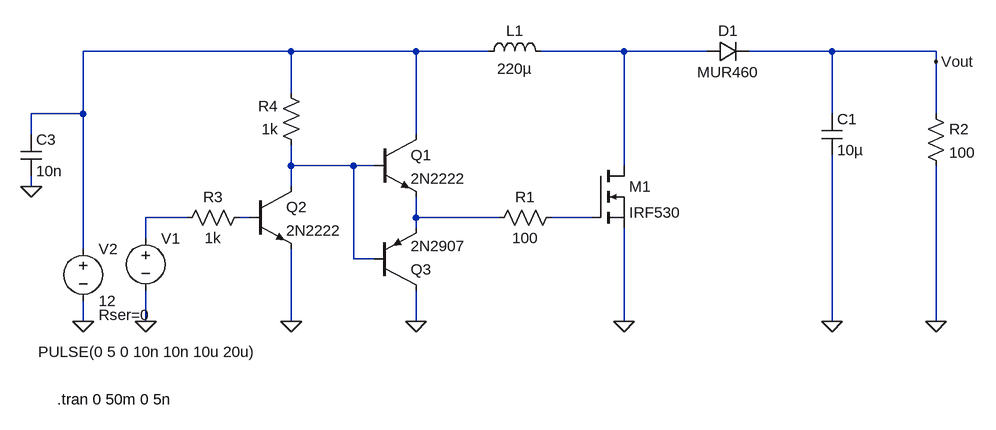
[diagram p0: schematic sim2.asc]
sim2.asc, the LTspice schematic file:
Version 4
SHEET 1 1204 748
WIRE 144 -144 -176 -144
WIRE 336 -144 144 -144
WIRE 448 -144 336 -144
WIRE 656 -144 528 -144
WIRE 784 -144 656 -144
WIRE 976 -144 848 -144
WIRE 1136 -144 976 -144
WIRE 1136 -128 1136 -144
WIRE 144 -80 144 -144
WIRE -176 -48 -176 -144
WIRE -176 -48 -256 -48
WIRE 976 -48 976 -144
WIRE 1136 -48 1136 -128
WIRE -256 -16 -256 -48
WIRE 336 -16 336 -144
WIRE 144 32 144 0
WIRE 240 32 144 32
WIRE 272 32 240 32
WIRE 656 32 656 -144
WIRE -256 64 -256 48
WIRE 144 64 144 32
WIRE -16 112 -80 112
WIRE 80 112 64 112
WIRE 336 112 336 80
WIRE 464 112 336 112
WIRE 608 112 544 112
WIRE 336 128 336 112
WIRE -80 144 -80 112
WIRE -176 160 -176 -48
WIRE 240 176 240 32
WIRE 272 176 240 176
WIRE -176 272 -176 240
WIRE -80 272 -80 224
WIRE 144 272 144 160
WIRE 336 272 336 224
WIRE 656 272 656 128
WIRE 976 272 976 16
WIRE 1136 272 1136 32
FLAG -176 272 0
FLAG -80 272 0
FLAG 144 272 0
FLAG 336 272 0
FLAG 656 272 0
FLAG 976 272 0
FLAG 1136 272 0
FLAG -256 64 0
FLAG 1136 -128 Vout
SYMBOL voltage -176 144 R0
WINDOW 123 0 0 Left 2
WINDOW 39 24 118 Left 2
SYMATTR SpiceLine Rser=0
SYMATTR InstName V2
SYMATTR Value 12
SYMBOL res 448 128 R270
WINDOW 0 32 56 VTop 2
WINDOW 3 0 56 VBottom 2
SYMATTR InstName R1
SYMATTR Value 100
SYMBOL ind 432 -128 R270
WINDOW 0 32 56 VTop 2
WINDOW 3 5 56 VBottom 2
SYMATTR InstName L1
SYMATTR Value 220µ
SYMBOL res 160 16 R180
WINDOW 0 36 76 Left 2
WINDOW 3 36 40 Left 2
SYMATTR InstName R4
SYMATTR Value 1k
SYMBOL npn 80 64 R0
SYMATTR InstName Q2
SYMATTR Value 2N2222
SYMBOL res 80 96 R90
WINDOW 0 0 56 VBottom 2
WINDOW 3 32 56 VTop 2
SYMATTR InstName R3
SYMATTR Value 1k
SYMBOL voltage -80 128 R0
WINDOW 3 -165 191 Left 2
SYMATTR Value PULSE(0 5 0 10n 10n 10u 20u)
SYMATTR InstName V1
SYMBOL npn 272 -16 R0
SYMATTR InstName Q1
SYMATTR Value 2N2222
SYMBOL nmos 608 32 R0
SYMATTR InstName M1
SYMATTR Value IRF530
SYMBOL diode 784 -128 R270
WINDOW 0 32 32 VTop 2
WINDOW 3 0 32 VBottom 2
SYMATTR InstName D1
SYMATTR Value MUR460
SYMBOL cap 960 -48 R0
SYMATTR InstName C1
SYMATTR Value 10µ
SYMBOL res 1120 -64 R0
SYMATTR InstName R2
SYMATTR Value 100
SYMBOL pnp 272 224 M180
SYMATTR InstName Q3
SYMATTR Value 2N2907
SYMBOL Cap -272 -16 R0
SYMATTR InstName C3
SYMATTR Value 10n
TEXT -216 392 Left 2 !.tran 0 50m 0 5n

The netlist it stands for:
* sim2.asc
V2 N001 0 12 Rser=0
R1 N006 N007 100
L1 N001 N002 220µ
R4 N003 N001 1k
Q2 N003 N005 0 0 2N2222
R3 N005 N004 1k
V1 N004 0 PULSE(0 5 0 10n 10n 10u 20u)
Q1 N001 N003 N006 0 2N2222
M1 N002 N007 0 0 IRF530
D1 N002 Vout MUR460
C1 Vout 0 10µ
R2 Vout 0 100
Q3 0 N003 N006 0 2N2907
C3 N001 0 10n
.model D D
.lib standard.dio
.model NPN NPN
.model PNP PNP
.lib standard.bjt
.model NMOS NMOS
.model PMOS PMOS
.lib standard.mos
.tran 0 50m 0 5n
.backanno
.end